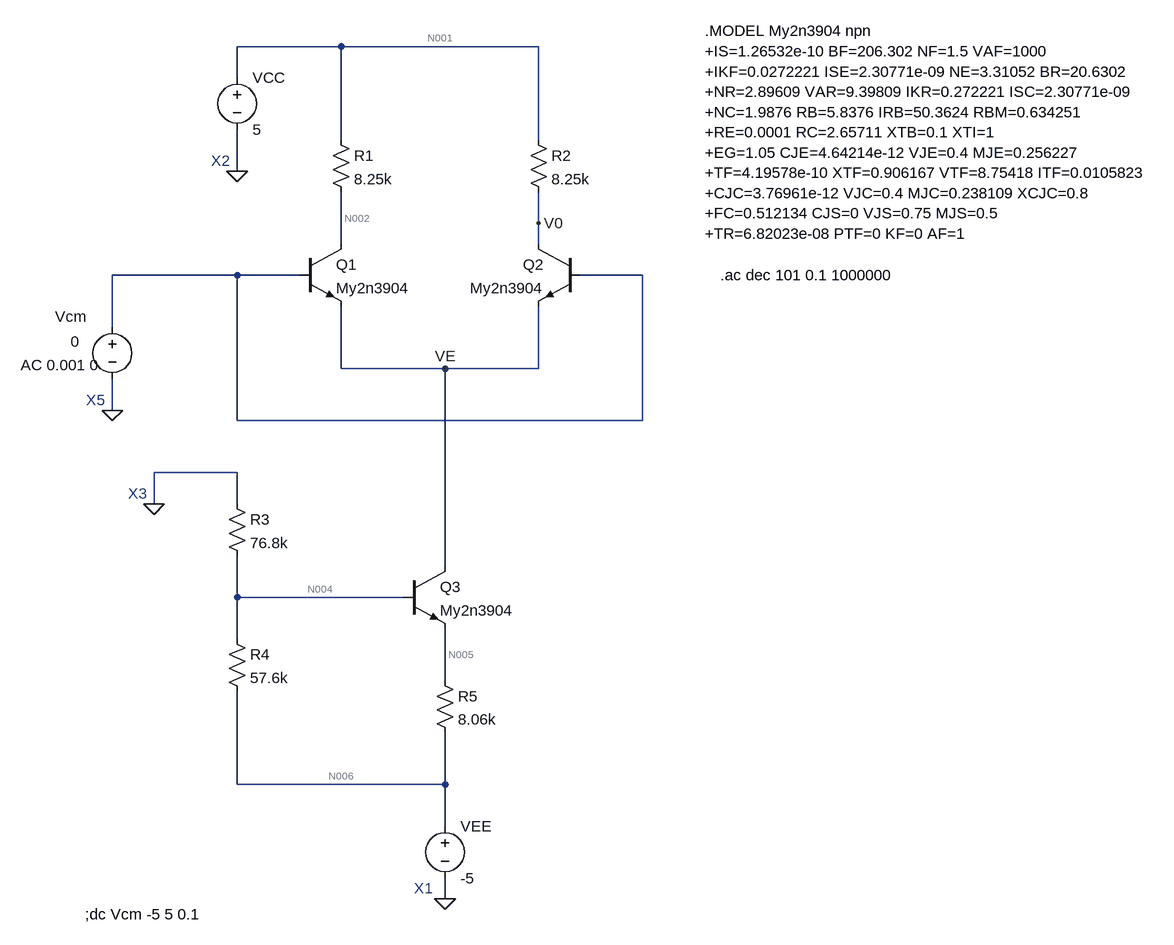
[diagram p0: schematic 2.5.asc]
2.5.asc, the LTspice schematic file:
Version 4
SHEET 1 1712 1224
WIRE 128 -128 -32 -128
WIRE 432 -128 128 -128
WIRE -32 -80 -32 -128
WIRE 128 16 128 -128
WIRE 432 16 432 -128
WIRE -32 64 -32 0
WIRE 432 144 432 96
WIRE 128 176 128 96
WIRE 432 176 432 144
WIRE -32 224 -224 224
WIRE 64 224 -32 224
WIRE 592 224 496 224
WIRE -224 304 -224 224
WIRE 128 368 128 272
WIRE 288 368 128 368
WIRE 432 368 432 272
WIRE 432 368 288 368
WIRE -224 432 -224 384
WIRE -32 448 -32 224
WIRE 592 448 592 224
WIRE 592 448 -32 448
WIRE -32 528 -160 528
WIRE -160 576 -160 528
WIRE -32 576 -32 528
WIRE 288 672 288 368
WIRE -32 720 -32 656
WIRE 224 720 -32 720
WIRE -32 784 -32 720
WIRE 288 848 288 768
WIRE -32 1008 -32 864
WIRE 288 1008 288 928
WIRE 288 1008 -32 1008
WIRE 288 1072 288 1008
WIRE 288 1184 288 1152
FLAG -32 64 0
FLAG -224 432 0
FLAG -160 576 0
FLAG 288 1184 0
FLAG 288 368 VE
FLAG 432 144 V0
SYMBOL res 112 0 R0
SYMATTR InstName R1
SYMATTR Value 8.25k
SYMBOL res 416 0 R0
SYMATTR InstName R2
SYMATTR Value 8.25k
SYMBOL res -48 560 R0
SYMATTR InstName R3
SYMATTR Value 76.8k
SYMBOL res -48 768 R0
SYMATTR InstName R4
SYMATTR Value 57.6k
SYMBOL res 272 832 R0
SYMATTR InstName R5
SYMATTR Value 8.06k
SYMBOL voltage -32 -96 R0
WINDOW 123 0 0 Left 0
WINDOW 39 0 0 Left 0
SYMATTR InstName VCC
SYMATTR Value 5
SYMBOL npn 64 176 R0
SYMATTR InstName Q1
SYMATTR Value My2n3904
SYMBOL npn 496 176 M0
SYMATTR InstName Q2
SYMATTR Value My2n3904
SYMBOL voltage -224 288 R0
WINDOW 0 -88 0 Left 2
WINDOW 3 -64 38 Left 2
WINDOW 123 -141 74 Left 2
WINDOW 39 0 0 Left 0
SYMATTR InstName Vcm
SYMATTR Value 0
SYMATTR Value2 AC 0.001 0
SYMBOL npn 224 672 R0
SYMATTR InstName Q3
SYMATTR Value My2n3904
SYMBOL voltage 288 1056 R0
WINDOW 123 0 0 Left 0
WINDOW 39 0 0 Left 0
SYMATTR InstName VEE
SYMATTR Value -5
TEXT -72 48 Left 2 ;X2
TEXT -264 416 Left 2 ;X5
TEXT -200 560 Left 2 ;X3
TEXT 240 1168 Left 2 ;X1
TEXT 688 -152 Left 2 !.MODEL My2n3904 npn\n+IS=1.26532e-10 BF=206.302 NF=1.5 VAF=1000\n+IKF=0.0272221 ISE=2.30771e-09 NE=3.31052 BR=20.6302\n+NR=2.89609 VAR=9.39809 IKR=0.272221 ISC=2.30771e-09\n+NC=1.9876 RB=5.8376 IRB=50.3624 RBM=0.634251\n+RE=0.0001 RC=2.65711 XTB=0.1 XTI=1\n+EG=1.05 CJE=4.64214e-12 VJE=0.4 MJE=0.256227\n+TF=4.19578e-10 XTF=0.906167 VTF=8.75418 ITF=0.0105823\n+CJC=3.76961e-12 VJC=0.4 MJC=0.238109 XCJC=0.8\n+FC=0.512134 CJS=0 VJS=0.75 MJS=0.5\n+TR=6.82023e-08 PTF=0 KF=0 AF=1
TEXT -266 1208 Left 2 !;dc Vcm -5 5 0.1
TEXT 712 224 Left 2 !.ac dec 101 0.1 1000000

The netlist it stands for:
* 2.5.asc
R1 N001 N002 8.25k
R2 N001 V0 8.25k
R3 0 N004 76.8k
R4 N004 N006 57.6k
R5 N005 N006 8.06k
VCC N001 0 5
Q1 N002 N003 VE 0 My2n3904
Q2 V0 N003 VE 0 My2n3904
Vcm N003 0 0 AC 0.001 0
Q3 VE N004 N005 0 My2n3904
VEE N006 0 -5
.model NPN NPN
.model PNP PNP
.lib standard.bjt
* X2
* X5
* X3
* X1
.MODEL My2n3904 npn
+IS=1.26532e-10 BF=206.302 NF=1.5 VAF=1000
+IKF=0.0272221 ISE=2.30771e-09 NE=3.31052 BR=20.6302
+NR=2.89609 VAR=9.39809 IKR=0.272221 ISC=2.30771e-09
+NC=1.9876 RB=5.8376 IRB=50.3624 RBM=0.634251
+RE=0.0001 RC=2.65711 XTB=0.1 XTI=1
+EG=1.05 CJE=4.64214e-12 VJE=0.4 MJE=0.256227
+TF=4.19578e-10 XTF=0.906167 VTF=8.75418 ITF=0.0105823
+CJC=3.76961e-12 VJC=0.4 MJC=0.238109 XCJC=0.8
+FC=0.512134 CJS=0 VJS=0.75 MJS=0.5
+TR=6.82023e-08 PTF=0 KF=0 AF=1
;dc Vcm -5 5 0.1
.ac dec 101 0.1 1000000
.backanno
.end

* Results of the author's LTspice run, read from the files saved beside the schematic
* Operating Point, zero values left out:
*   V(n001) = 5 V
*   V(n002) = 4.25 V
*   V(v0) = 4.25 V
*   V(n004) = -2.937 V
*   V(n006) = -5 V
*   V(n005) = -3.49 V
*   V(ve) = -525.4 mV
*   Ic(Q3) = 184.9 µA
*   Ib(Q3) = 2.429 µA
*   Ie(Q3) = -187.3 µA
*   Ic(Q2) = 90.91 µA
*   Ib(Q2) = 1.528 µA
*   Ie(Q2) = -92.44 µA
*   Ic(Q1) = 90.91 µA
*   Ib(Q1) = 1.528 µA
*   Ie(Q1) = -92.44 µA
*   I(R5) = 187.3 µA
*   I(R4) = 35.81 µA
*   I(R3) = 38.24 µA
*   I(R2) = 90.91 µA
*   I(R1) = 90.91 µA
*   I(Vee) = 223.1 µA
*   I(Vcm) = -3.056 µA
*   I(Vcc) = -181.8 µA
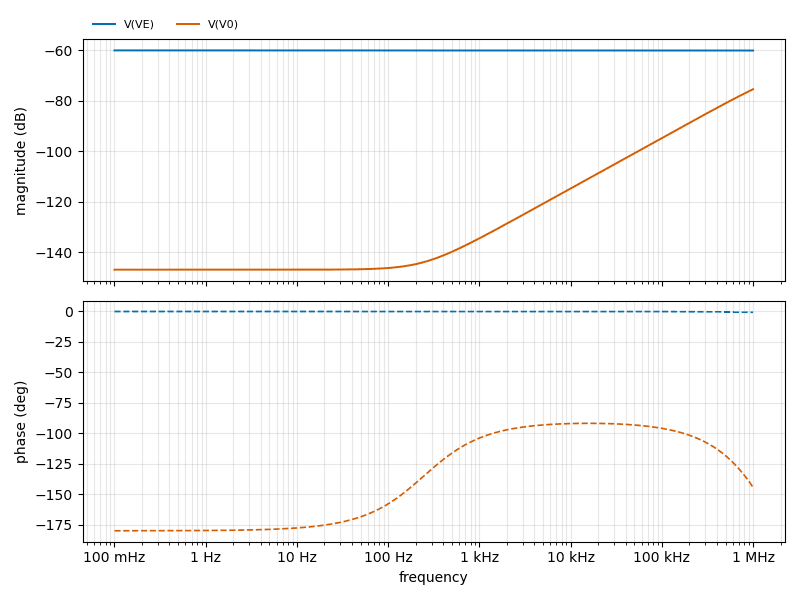
[diagram p1: AC Analysis of 2.5.asc, plotted from the saved traces]
* AC Analysis, 1 run:
*   V(VE): -60.00 dB at 100 mHz, -60.06 dB at 1 MHz, peak -60.00 dB at 100 mHz
*   V(V0): -146.90 dB at 100 mHz, -75.39 dB at 1 MHz, peak -75.39 dB at 1 MHz, 3 dB below the peak at 681.3 kHz